# Altium schematic sheet Battery_Control.SchDoc
size A4
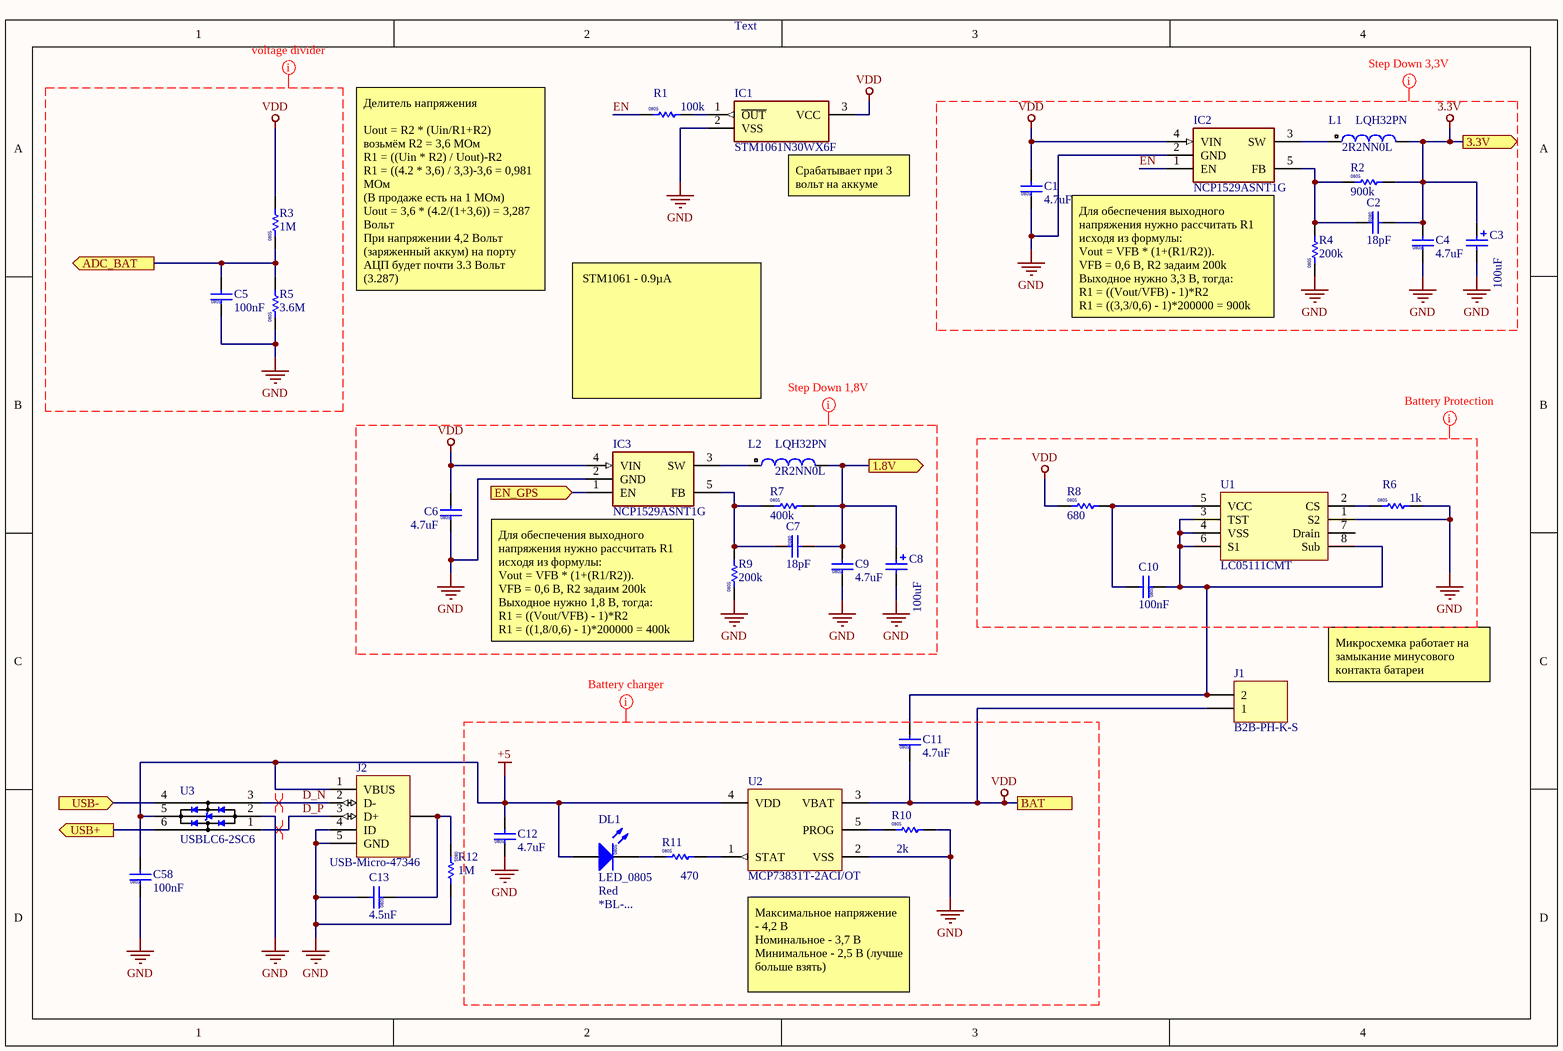
[diagram p0: Battery_Control.SchDoc]

## Parts
C1  value 4.7uF  [CAPC2012-0805M]  (hidden comment: CAPC_0805)
C2  value 18pF  [CAPC2012-0805M]  (hidden comment: CAPC_0805)
C3  value 100uF  [ECAPC_0505]  (hidden comment: ECAPC_0505)
C4  value 4.7uF  [CAPC2012-0805M]  (hidden comment: CAPC_0805)
C5  value 100nF  [CAPC2012-0805M]  (hidden comment: CAPC_0805)
C6  value 4.7uF  [CAPC2012-0805M]  (hidden comment: CAPC_0805)
C7  value 18pF  [CAPC2012-0805M]  (hidden comment: CAPC_0805)
C8  value 100uF  [ECAPC_0505]  (hidden comment: ECAPC_0505)
C9  value 4.7uF  [CAPC2012-0805M]  (hidden comment: CAPC_0805)
C10  value 100nF  [CAPC2012-0805M]  (hidden comment: CAPC_0805)
C11  value 4.7uF  [CAPC2012-0805M]  (hidden comment: CAPC_0805)
C12  value 4.7uF  [CAPC2012-0805M]  (hidden comment: CAPC_0805)
C13  value 4.5nF  [CAPC2012-0805M]  (hidden comment: CAPC_0805)
C58  value 100nF  [CAPC2012-0805M]  (hidden comment: CAPC_0805)
DL1  LED_0805  Color: Red  Part number: *BL-...  [DIODEC2012-0805]
IC1  STM1061N30WX6F  [SOT103P237X112-3N]
IC2  NCP1529ASNT1G  [SOT95P275X110-5N]
IC3  NCP1529ASNT1G  [SOT95P275X110-5N]
J1  B2B-PH-K-S  [B2B-PH-K-S]
J2  USB-Micro-47346  [USB_micro_B]
L1  LQH32PN  value 2R2NN0L  [LQH32PN_N]
L2  LQH32PN  value 2R2NN0L  [LQH32PN_N]
R1  value 100k  [RESC2012-0805M]  (hidden comment: RESC_0805)
R2  value 900k  [RESC2012-0805M]  (hidden comment: RESC_0805)
R3  value 1M  [RESC2012-0805M]  (hidden comment: RESC_0805)
R4  value 200k  [RESC2012-0805M]  (hidden comment: RESC_0805)
R5  value 3.6M  [RESC2012-0805M]  (hidden comment: RESC_0805)
R6  value 1k  [RESC2012-0805M]  (hidden comment: RESC_0805)
R7  value 400k  [RESC2012-0805M]  (hidden comment: RESC_0805)
R8  value 680  [RESC2012-0805M]  (hidden comment: RESC_0805)
R9  value 200k  [RESC2012-0805M]  (hidden comment: RESC_0805)
R10  value 2k  [RESC2012-0805M]  (hidden comment: RESC_0805)
R11  value 470  [RESC2012-0805M]  (hidden comment: RESC_0805)
R12  value 1M  [RESC2012-0805M]  (hidden comment: RESC_0805)
U1  LC05111CMT  [WDFN6 2.6x4.0, 0.65P]
U2  MCP73831T-2ACI/OT  [SOT-23-OT5_N]
U3  USBLC6-2SC6  [SOT23-6L_ST]

## Ports
1.8V (out), 3.3V (out), ADC_BAT (out), BAT, EN_GPS (in), USB+ (out), USB- (in)

## Nets
3.3V: C2.2 C3.1 C4.2 L1.2 R2.2 ; port 3.3V
+5: C12.2 C58.2 DL1.1(A) J2.1(VBUS) U2.4(VDD) U3.5(Vbus)
GND: C1.1 C3.2 C4.1 C5.1 C6.1 C8.2 C9.1 C12.1 C13.2 C58.1 IC1.2(VSS) IC2.2(GND) IC3.2(GND) J2.4(ID) J2.5(GND) R4.1 R5.1 R6.2 R9.1 R10.2 R12.2 U1.1(S2) U2.2(VSS) U3.2(GND)
VDD: C1.2 C6.2 C11.1 IC1.3(VCC) IC2.4(VIN) IC3.4(VIN) J1.1 R3.2 R8.1 U2.3(VBAT) ; port BAT
1.8V: C7.2 C8.1 C9.2 L2.2 R7.2 ; port 1.8V
ADC_BAT: C5.2 R3.1 R5.2 ; port ADC_BAT
D_N: J2.2(D-) U3.3(IO2)
D_P: J2.3(D+) U3.1(IO1)
EN: IC2.1(EN) R1.1
EN_GPS: IC3.1(EN) ; port EN_GPS
USB+: U3.6(IO1) ; port USB+
USB-: U3.4(IO2) ; port USB-
NetC2_1: C2.1 IC2.5(FB) R2.1 R4.2
NetC7_1: C7.1 IC3.5(FB) R7.1 R9.2
NetC10_1: C10.1 C11.2 J1.2 U1.3(TST) U1.4(VSS) U1.6(S1) U1.8(Sub)
NetC10_2: C10.2 R8.2 U1.5(VCC)
NetC13_1: C13.1 J2.SHIELD(SHLD) R12.1
NetDL1_2: DL1.2(K) R11.1
NetIC1_1: IC1.1(~{OUT}) R1.2
NetIC2_3: IC2.3(SW) L1.1
NetIC3_3: IC3.3(SW) L2.1
NetR6_1: R6.1 U1.2(CS)
NetR10_1: R10.1 U2.5(PROG)
NetR11_2: R11.2 U2.1(STAT)

Not connected (* = marked no-connect by the designer): U1 7(Drain)

## Layout directives
mark named voltage divider: GND, VDD
net class POWER: 3.3V, +5, EN, GND, VDD
differential pair: D_N, D_P

## Notes on the sheet
- Text
- (near IC1) Срабатывает при 3 вольт на аккуме
- Делитель напряжения
  Uout = R2 * (Uin/R1+R2)
  возьмём R2 = 3,6 МОм
  R1 = ((Uin * R2) / Uout)-R2
  R1 = ((4.2 * 3,6) / 3,3)-3,6 = 0,981 МОм
  (В продаже есть на 1 МОм)
  Uout = 3,6 * (4.2/(1+3,6)) = 3,287 Вольт
  При напряжении 4,2 Вольт (заряженный аккум) на порту АЦП будет почти 3.3 Вольт (3.287)
- Для обеспечения выходного напряжения нужно рассчитать R1 исходя из формулы:
  Vout = VFB * (1+(R1/R2)).
  VFB = 0,6 В, R2 задаим 200k
  Выходное нужно 3,3 В, тогда:
  R1 = ((Vout/VFB) - 1)*R2
  R1 = ((3,3/0,6) - 1)*200000 = 900k
- STM1061 - 0.9µA
- Для обеспечения выходного напряжения нужно рассчитать R1 исходя из формулы:
  Vout = VFB * (1+(R1/R2)).
  VFB = 0,6 В, R2 задаим 200k
  Выходное нужно 1,8 В, тогда:
  R1 = ((Vout/VFB) - 1)*R2
  R1 = ((1,8/0,6) - 1)*200000 = 400k
- Микросхемка работает на замыкание минусового контакта батареи
- (near U2) Максимальное напряжение - 4,2 В
  Номинальное - 3,7 В
  Минимальное - 2,5 В (лучше больше взять)
- (in symbol CAPC_0805) 0805
- (in symbol LED_0805) 0805
- (in symbol RESC_0805) 0805

## Library data of the parts
C1 C2 C4-C7 C9-C13 C58 = CAPC_0805: Capacitor 0805
C3 C8 = ECAPC_0505: Electrolytic Capacitor SMD 0505; Published: 8-Jun-2000; LatestRevisionDate: 17-Jul-2002; LatestRevisionNote: Re-released for DXP Platform.; PackageReference: C0805; Publisher: Altium Limited
DL1 = LED_0805: LED 0805
IC1 = STM1061N34WX6F: Integrated Circuit; Manufacturer_Name: STMicroelectronics; Allied_Number: 70014045; Datasheet Link: http://www.st.com/web/en/resource/technical/document/datasheet/CD00065467.pdf; Height: 1.12mm; Manufacturer_Part_Number: STM1061N34WX6F; Mouser Part Number: 511-STM1061N34WX6F; Mouser Price/Stock: https://www.mouser.com/Search/Refine.aspx?Keyword=511-STM1061N34WX6F; RS Part Number: 6864784; RS Price/Stock: https://uk.rs-online.com/web/p/products/6864784; Allied Price/Stock: http://www.alliedelec.com/stmicroelectronics-stm1061n34wx6f/70014045/
IC2 IC3 = NCP1529ASNT1G: Integrated Circuit; Manufacturer_Name: ON Semiconductor; Allied_Number: 70466941; Datasheet Link: http://www.onsemi.com/pub/Collateral/NCP1529-D.PDF; Height: 1.1mm; Manufacturer_Part_Number: NCP1529ASNT1G; Mouser Part Number: 863-NCP1529ASNT1G; Mouser Price/Stock: https://www.mouser.com/Search/Refine.aspx?Keyword=863-NCP1529ASNT1G; RS Part Number: 8023161P; RS Price/Stock: http://uk.rs-online.com/web/p/products/8023161P; Allied Price/Stock: http://www.alliedelec.com/on-semiconductor-ncp1529asnt1g/70466941/
J1 = B2B-PH-K-S: B2B-PH-K-S 2.0 mm pitrch header PCB straight
J2 = USB-Micro-47346: Micro USB B Molex 47346; ComponentLink1Description: Manufacturer Link; ComponentLink1URL: http://www.tycoelectronics.com/
L1 L2 = LQH32PN: LQH32PN Murata inductor; Code_IEC: 1005; Published: 8-Jun-2000; LatestRevisionDate: 17-Jul-2002; LatestRevisionNote: Re-released for DXP Platform.; PackageReference: 0402-A; Publisher: Altium Limited; Code_JEITA: 0402
R1-R12 = RESC_0805: Resistor 0805
U1 = LC05111CMT: Защита Li-On от перезаряда переразряда; Rule: UNIONINDEX=0|RULEKIND=Width|NETSCOPE=AnyNet|LAYERKIND=SameLayer|NAME=Schematic Width Constraint|MAXLIMIT=20mil|MINLIMIT=10mil|PREFEREDWIDTH=15mil|UNIT=Imperial; ClassName: Small
U2 = MCP73831T-2ACI/OT: Miniature Single-Cell, Fully Integrated Li-Ion, Li-Polymer Charge Management Controller, 4.2V, 5-Pin SOT-23, Industrial Temperature, Tape and Reel; Manufacturer: Microchip; DatasheetVersion: revE, Sep-2008; PackageVersion: revBB, Aug-2009; PackageReference: SOT-23-OT5; PackageDescription: 5-Lead Plastic Small Outline Transistor (OT) [SOT-23]; Supplier 1: Digi-Key; Supplier Part Number 1: MCP73831T-2ACI/OTTR-ND; Supplier 2: Digi-Key; Supplier Part Number 2: MCP73831T-2ACI/OTCT-ND; Supplier 3: Digi-Key; Supplier Part Number 3: MCP73831T-2ACI/OTDKR-ND; Supplier 4: Farnell; Supplier Part Number 4: 1332158; Supplier 5: Farnell; Supplier Part Number 5: 1332158RL; Supplier 6: Newark; Supplier Part Number 6: 56K7045; Supplier 7: Mouser; Supplier Part Number 7: 579-MCP73831T-2ACIOT; Mounting Technology: Surface Mount; Code_IPC: SOT23-5; PartNumber: MCP73831T-2ACI/OT; ComponentLink1Description: Manufacturer URL; ComponentLink1URL: http://www.microchip.com/; ComponentLink2Description: Datasheet; ComponentLink2URL: http://ww1.microchip.com/downloads/en/DeviceDoc/21984e.pdf; ComponentLink3Description: Package Specification; ComponentLink3URL: http://www.microchip.com/stellent/groups/techpub_sg/documents/packagingspec/en012702.pdf
U3 = USBLC6-2SC6: USBLC6-2SC6 ESD protection diodes assembly